# EAGLE design VCLFO_th_2 (EAGLE 7.7.0)
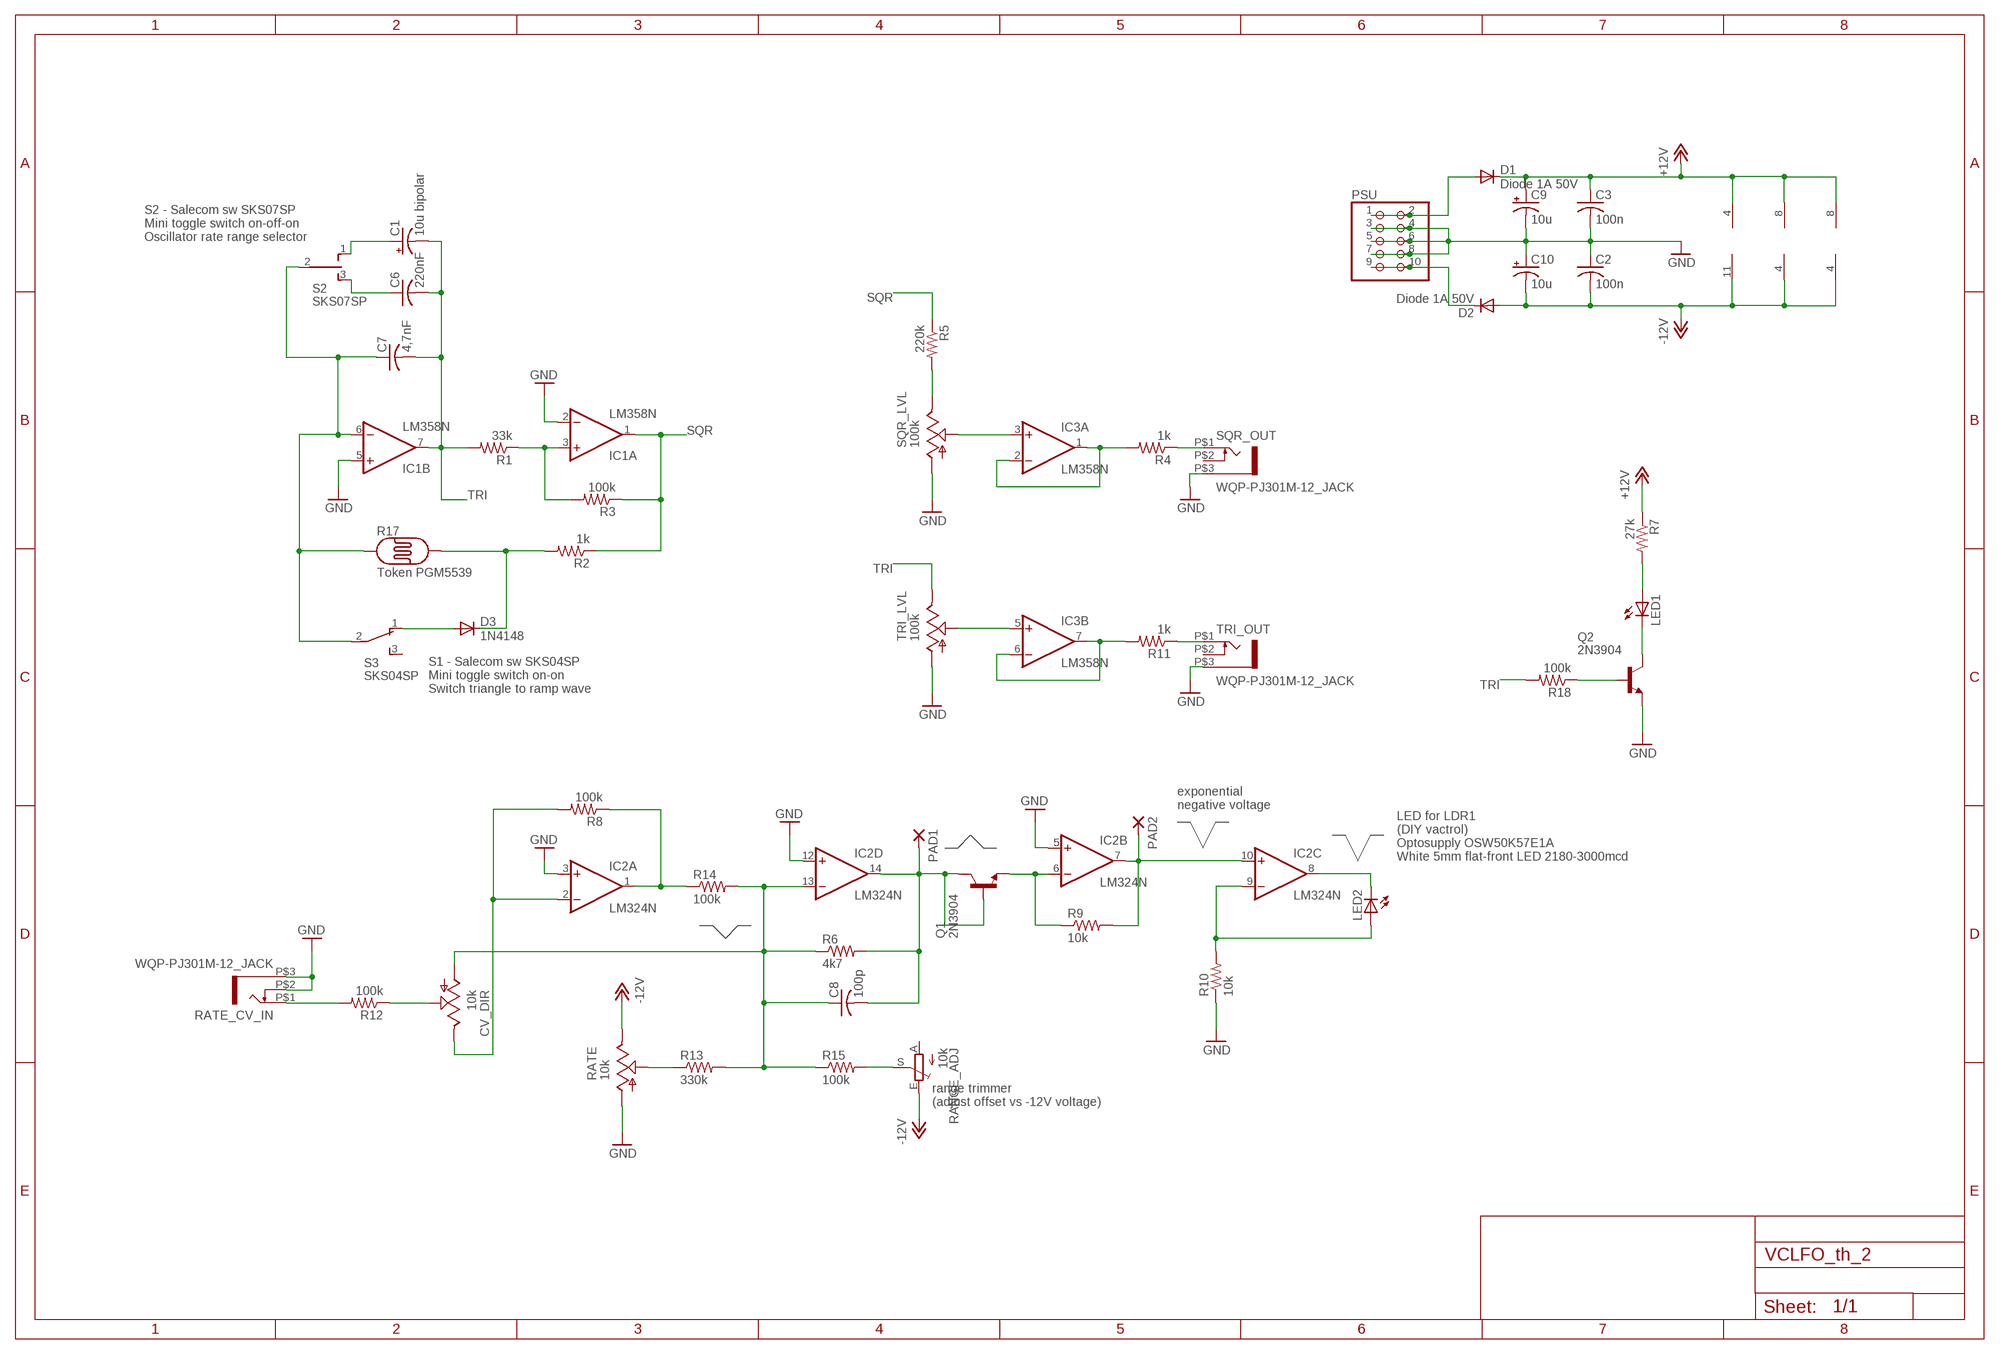
[diagram p0: schematic, sheet 1]

## Parts
C1  10u bipolar  CPOL-USE2.5-5  [E2,5-5]
C2  100n  C-US025-025X050  [C025-025X050]
C3  100n  C-US025-025X050  [C025-025X050]
C6  220nF  C-US050-025X075  [C050-025X075]
C7  4,7nF  C-US025-025X050  [C025-025X050]
C8  100p  C-US025-025X050  [C025-025X050]
C9  10u  CPOL-USE2.5-5  [E2,5-5]
C10  10u  CPOL-USE2.5-5  [E2,5-5]
CV_DIR  10k  POT_USVERTICAL  [ALPS_POT_VERTICAL]
D1  Diode 1A 50V  DIODE-D-2.5  [D-2.5]
D2  Diode 1A 50V  DIODE-D-2.5  [D-2.5]
D3  1N4148  DIODE-D-5  [D-5]
IC1  LM358N  [DIL08]
IC2  LM324N  [DIL14]
IC3  LM358N  [DIL08]
LED1  LED5MM  [LED5MM]
LED2  LED5MM  [LED5MM]
PAD1  1,6/0,8  [1,6/0,8]
PAD2  1,6/0,8  [1,6/0,8]
PSU  PINHD-2X5  [2X05]
Q1  2N3904  [TO92]
Q2  2N3904  [TO92]
R1  33k  R-US_0204/2V  [0204V]
R2  1k  R-US_0204/2V  [0204V]
R3  100k  R-US_0204/2V  [0204V]
R4  1k  R-US_0204/2V  [0204V]
R5  220k  R-US_0204/2V  [0204V]
R6  4k7  R-US_0204/2V  [0204V]
R7  27k  R-US_0204/2V  [0204V]
R8  100k  R-US_0204/2V  [0204V]
R9  10k  R-US_0204/2V  [0204V]
R10  10k  R-US_0204/2V  [0204V]
R11  1k  R-US_0204/2V  [0204V]
R12  100k  R-US_0204/2V  [0204V]
R13  330k  R-US_0204/2V  [0204V]
R14  100k  R-US_0204/2V  [0204V]
R15  100k  R-US_0204/2V  [0204V]
R17  Token PGM5539  PHOTOCELLPTH  [PHOTOCELL]
R18  100k  R-US_0204/2V  [0204V]
RANGE_ADJ  10k  TRIM_EU-B25P  [B25P]
RATE  10k  POT_USVERTICAL  [ALPS_POT_VERTICAL]
RATE_CV_IN  WQP-PJ301M-12_JACK  [WQP-PJ301M-12_JACK]
S2  SKS07SP  TL39PO  [TL3XPO]
S3  SKS04SP  TL36PO  [TL3XPO]
SQR_LVL  100k  POT_USVERTICAL  [ALPS_POT_VERTICAL]
SQR_OUT  WQP-PJ301M-12_JACK  [WQP-PJ301M-12_JACK]
TRI_LVL  100k  POT_USVERTICAL  [ALPS_POT_VERTICAL]
TRI_OUT  WQP-PJ301M-12_JACK  [WQP-PJ301M-12_JACK]

## Nets
+12V: C3.1 C9.+ D1.C IC1.8(P:V+) IC2.4(P:V+) IC3.8(P:V+) R7.1
-12V: C2.2 C10.- D2.A IC1.4(P:V-) IC2.11(P:V-) IC3.4(P:V-) RANGE_ADJ.E RATE.P$1(E)
GND: C2.1 C3.2 C9.- C10.+ IC1.2(A:-IN) IC1.5(B:+IN) IC2.3(A:+IN) IC2.5(B:+IN) IC2.12(D:+IN) PSU.3 PSU.4 PSU.5 PSU.6 PSU.7 PSU.8 Q2.3(E) R10.1 RATE.P$3(A) RATE_CV_IN.P$2 RATE_CV_IN.P$3 SQR_LVL.P$3(A) SQR_OUT.P$3 TRI_LVL.P$3(A) TRI_OUT.P$3
N$1: C7.1 IC1.6(B:-IN) R17.1 S2.2(P) S3.2(P)
N$2: D3.C R2.2 R17.2
N$3: IC3.1(A:OUT) IC3.2(A:-IN) R4.2
N$4: R5.2 SQR_LVL.P$1(E)
N$5: IC1.3(A:+IN) R1.1 R3.2
N$6: R4.1 SQR_OUT.P$1
N$7: CV_DIR.P$1(E) IC2.2(A:-IN) R8.2
N$8: IC3.6(B:-IN) IC3.7(B:OUT) R11.2
N$9: IC3.3(A:+IN) SQR_LVL.P$2(S)
N$10: D1.A PSU.1 PSU.2
N$11: D2.C PSU.9 PSU.10
N$12: R12.2 RATE_CV_IN.P$1
N$13: C8.2 IC2.14(D:OUT) PAD1.1(P) Q1.1(C) Q1.2(B) R6.2
N$14: C1.+ S2.1(O)
N$15: CV_DIR.P$2(S) R12.1
N$16: D3.A S3.1(O)
N$17: R11.1 TRI_OUT.P$1
N$18: R13.1 RATE.P$2(S)
N$19: C6.1 S2.3(S)
N$20: Q2.2(B) R18.1
N$21: IC2.6(B:-IN) Q1.3(E) R9.1
N$22: IC2.1(A:OUT) R8.1 R14.1
N$23: C8.1 CV_DIR.P$3(A) IC2.13(D:-IN) R6.1 R13.2 R14.2 R15.1
N$24: IC2.7(B:OUT) IC2.10(C:+IN) PAD2.1(P) R9.2
N$25: R15.2 RANGE_ADJ.S
N$26: IC2.8(C:OUT) LED2.K(C)
N$27: IC2.9(C:-IN) LED2.A R10.2
N$28: IC3.5(B:+IN) TRI_LVL.P$2(S)
N$30: LED1.K(C) Q2.1(C)
N$31: LED1.A R7.2
SQR: IC1.1(A:OUT) R2.1 R3.1 R5.1
TRI: C1.- C6.2 C7.2 IC1.7(B:OUT) R1.2 R18.2 TRI_LVL.P$1(E)
Unconnected: RANGE_ADJ.A S3.3(S) SQR_OUT.P$2 TRI_OUT.P$2

## Notes on the sheet
- S2 - Salecom sw SKS07SP
  Mini toggle switch on-off-on
  Oscillator rate range selector
- S1 - Salecom sw SKS04SP
  Mini toggle switch on-on
  Switch triangle to ramp wave
- exponential
  negative voltage
- LED for LDR1
  (DIY vactrol)
  Optosupply OSW50K57E1A
  White 5mm flat-front LED 2180-3000mcd
- range trimmer
  (adjust offset vs -12V voltage)

## Library data of the parts
C1 C9 C10 = rcl:CPOL-US: POLARIZED CAPACITOR, American symbol
C2 C3 C6-C8 = rcl:C-US: CAPACITOR, American symbol
CV_DIR RATE SQR_LVL TRI_LVL = pot-alps:POT_US
D1-D3 = diode:DIODE-: DIODE
IC1 IC3 = linear:LM358: OP AMP also LM158; LM258; LM2904 Source: http://cache.national.com/ds/LM/LM158.pdf
IC2 = linear:LM324: OP AMP
LED1 LED2 = led:LED: LED OSRAM: - CHIPLED LG R971, LG N971, LY N971, LG Q971, LY Q971, LO R971, LY R971 LH N974, LH R974 LS Q976, LO Q976, LY Q976 LO Q996 - Hyper CHIPLED LW Q18S LB Q993, LB Q99A, LB R99A - SideLED LS A670, LO A670, LY A670, LG A670, LP A670 LB A673, LV A673, LT A673, LW A673 LH A674 LY A675 LS A676, LA A676, LO A676, LY A676, LW A676 LS A679, LY A679, LG A679 - Hyper Micro SIDELED® LS Y876, LA Y876, LO Y876, LY Y876 LT Y87S - SmartLED LW L88C, LW L88S LB L89C, LB L89S, LG L890 LS L89K, LO L89K, LY L89K LS L896, LA L896, LO L896, LY L896 - TOPLED LS T670, LO T670, LY T670, LG T670, LP T670 LSG T670, LSP T670, LSY T670, LOP T670, LYG T670 LG T671, LOG T671, LSG T671 LB T673, LV T673, LT T673, LW T673 LH T674 LS T676, LA T676, LO T676, LY T676, LB T676, LH T676, LSB T676, LW T676 LB T67C, LV T67C, LT T67C, LS T67K, LO T67K, LY T67K, LW E67C LS E67B, LA E67B, LO E67B, LY E67B, LB E67C, LV E67C, LT E67C LW T67C LS T679, LY T679, LG T679 LS T770, LO T770, LY T770, LG T770, LP T770 LB T773, LV T773, LT T773, LW T773 LH T774 LS E675, LA E675, LY E675, LS T675 LS T776, LA T776, LO T776, LY T776, LB T776 LHGB T686 LT T68C, LB T68C - Hyper Mini TOPLED® LB M676 - Mini TOPLED Santana® LG M470 LS M47K, LO M47K, LY M47K Source: http://www.osram.convergy.de LUXEON: - LUMILED® LXK2-PW12-R00, LXK2-PW12-S00, LXK2-PW14-U00, LXK2-PW14-V00 LXK2-PM12-R00, LXK2-PM12-S00, LXK2-PM14-U00 LXK2-PE12-Q00, LXK2-PE12-R00, LXK2-PE12-S00, LXK2-PE14-T00, LXK2-PE14-U00 LXK2-PB12-K00, LXK2-PB12-L00, LXK2-PB12-M00, LXK2-PB14-N00, LXK2-PB14-P00, LXK2-PB14-Q00 LXK2-PR12-L00, LXK2-PR12-M00, LXK2-PR14-Q00, LXK2-PR14-R00 LXK2-PD12-Q00, LXK2-PD12-R00, LXK2-PD12-S00 LXK2-PH12-R00, LXK2-PH12-S00 LXK2-PL12-P00, LXK2-PL12-Q00, LXK2-PL12-R00 Source: www.luxeon.com KINGBRIGHT: KA-3528ASYC Source: www.kingbright.com
PAD1 PAD2 = wirepad:1,6/0,8: THROUGH-HOLE PAD
PSU = pinhead:PINHD-2X5: PIN HEADER
Q1 Q2 = transistor-npn:2N3904: NPN Transistor
R1-R15 R18 = rcl:R-US_: RESISTOR, American symbol
R17 = SparkFun-Sensors:PHOTOCELL: CdS photoresistor. This is a low cost way to detect light levels. Resistance decreases with more incoming light. SparkFun SKU: SEN-09088
RANGE_ADJ = pot:TRIM_EU-: POTENTIOMETER
RATE_CV_IN SQR_OUT TRI_OUT = thonkiconn:WQP-PJ301M-12_JACK
S2 = switch:TL39PO: TINY SWITCH ON OFF ON Source: http://www2.produktinfo.conrad.com/datenblaetter/700000-724999/705152-da-01-de-Subminiaturschalter_TL_36YO.pdf
S3 = switch:TL36PO: TINY SWITCH ON - ON Source: http://www2.produktinfo.conrad.com/datenblaetter/700000-724999/705152-da-01-de-Subminiaturschalter_TL_36YO.pdf

## Board
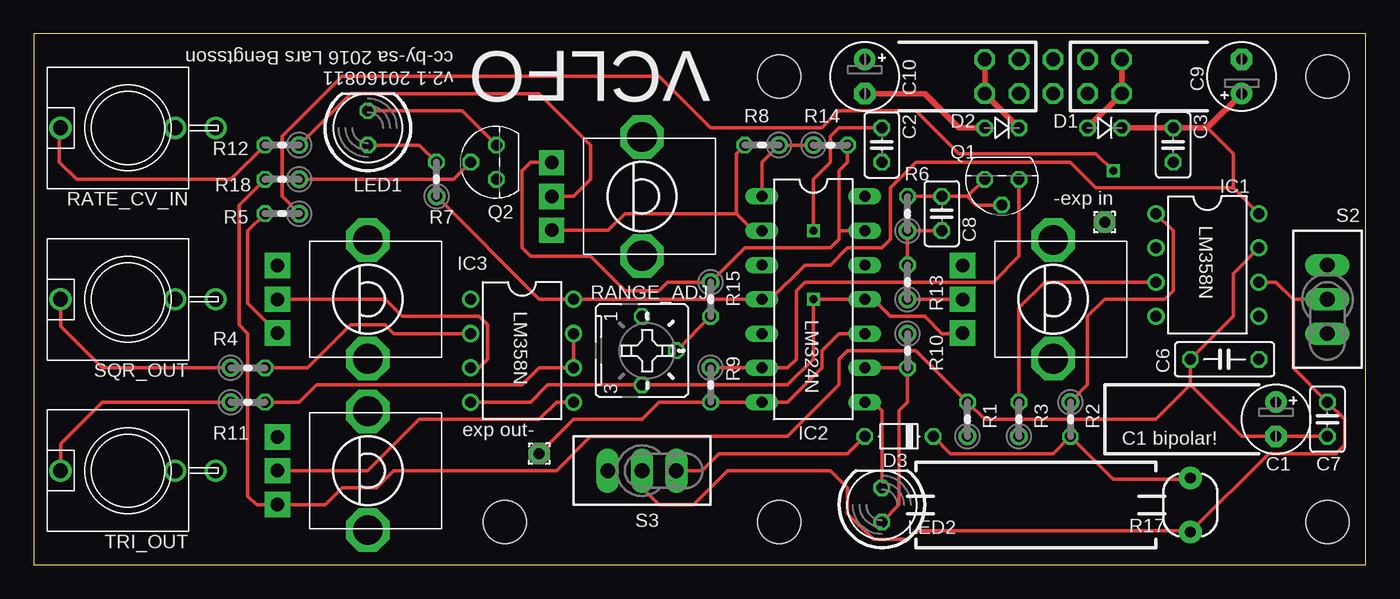
[diagram p1: board, top side]
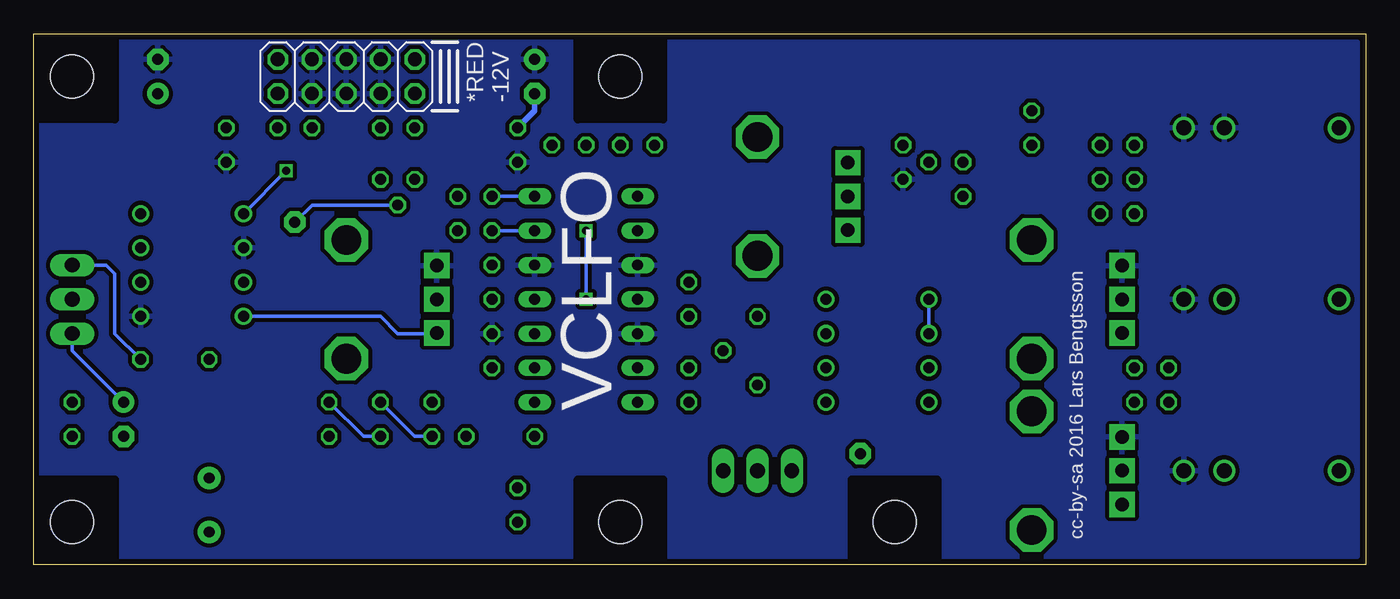
[diagram p2: board, bottom side, seen from below]

Size 98.73 x 39.36 mm. Coordinates in mm from the lower left corner, seen from the top.
Outline: 0,0 98.73,0 98.73,39.36 0,39.36 0,0
Copper layers (1*16): Top 0.0356mm / dielectric 1.5011mm / Bottom 0.0356mm
Design rules "LaenPCBOrder": minimum track width 6mil, minimum drill 13mil, track to track 6mil, track to pad 6mil, pad to pad 6mil, via to via 6mil, smd to smd 6mil, copper to edge 15mil, drill to drill 6mil, minimum pad ring 7mil, minimum via ring 7mil, stop-mask expansion 3mil, vias tented up to drill 0mil, thermal gap 10mil
Holes 3.2 mm at 95.88,36.2 95.88,3.18 55.25,3.18 34.93,3.18 55.25,36.2
bRestrict: area 52.1,33 to 58.4,39.4; area 31.8,0 to 38.1,6.4; area 52.1,0 to 58.4,6.4; area 92.7,0 to 99.1,6.4; area 92.7,33 to 99.1,39.4

### Footprints (pad centres in the part's own frame; a part is rotated, then mirrored left to right if it is on the bottom)
E2,5-5 = drill 0.813 pad 1.6: + -1.27,0 | drill 0.813 pad 1.6 octagon: - 1.27,0
C025-025X050 = drill 0.813 octagon: 1 -1.27,0; 2 1.27,0
C050-025X075 = drill 0.813 octagon: 1 -2.54,0; 2 2.54,0
ALPS_POT_VERTICAL = drill 1 pad 1.88 square: P$1 -2.5,6.7; P$2 0,6.7; P$3 2.5,6.7 | drill 2.2 pad 3.175 octagon: P$4 -4.4,0; P$5 4.4,0
D-2.5 = drill 0.813 octagon: A 1.27,0; C -1.27,0
D-5 = drill 0.813 octagon: A 2.54,0; C -2.54,0
DIL08 = drill 0.813 pad 1.27: 1 -3.81,-3.81; 2 -1.27,-3.81; 3 1.27,-3.81; 4 3.81,-3.81; 5 3.81,3.81; 6 1.27,3.81; 7 -1.27,3.81; 8 -3.81,3.81
DIL14 = drill 0.813 long: 1 -7.62,-3.81; 2 -5.08,-3.81; 3 -2.54,-3.81; 4 0,-3.81; 5 2.54,-3.81; 6 5.08,-3.81; 7 7.62,-3.81; 8 7.62,3.81; 9 5.08,3.81; 10 2.54,3.81; 11 0,3.81; 12 -2.54,3.81; 13 -5.08,3.81; 14 -7.62,3.81
LED5MM = drill 0.813 octagon: A -1.27,0; K 1.27,0
1,6/0,8 = drill 0.813 pad 1.6 octagon: 1 0,0
2X05 = drill 1.016 octagon: 1 -5.08,-1.27; 2 -5.08,1.27; 3 -2.54,-1.27; 4 -2.54,1.27; 5 0,-1.27; 6 0,1.27; 7 2.54,-1.27; 8 2.54,1.27; 9 5.08,-1.27; 10 5.08,1.27
TO92 = drill 0.813 octagon: 1 1.27,0; 2 0,1.905; 3 -1.27,0
0204V = drill 0.813 octagon: 1 -1.27,0; 2 1.27,0
PHOTOCELL = drill 0.8 pad 1.676: 1 -2,0; 2 2,0
B25P = drill 0.813 octagon: A -2.54,0; E 2.54,0; S 0,2.54
WQP-PJ301M-12_JACK = drill 1.1: P$1 0,5; P$2 0,-3.5; P$3 0,-6.5
TL3XPO = drill 1.1 pad 1.422 long: 1 -2.54,0; 2 0,0; 3 2.54,0

### Placement (x,y rotation side)
C1  92.07,10.8 270 top
C2  62.87,31.12 90 top
C3  84.45,31.12 270 top
C6  88.27,15.24 180 top
C7  95.88,10.8 270 top
C8  67.31,26.04 90 top
C9  89.53,36.2 90 top
C10  61.59,36.2 270 top
CV_DIR  45.09,27.3 90 top
D1  79.38,32.39 180 top
D2  71.75,32.39 180 top
D3  64.13,9.53 180 top
IC1  86.99,22.23 270 top
IC2  57.79,19.69 270 top
IC3  36.2,15.88 270 top
LED1  24.76,32.39 90 top
LED2  62.87,4.45 90 top
PAD1  79.38,25.4 0 top
PAD2  37.47,8.26 0 top
PSU  75.56,36.2 0 bottom
Q1  71.75,28.58 180 top
Q2  34.29,29.84 90 top
R1  69.21,10.8 90 top
R2  76.83,10.8 270 top
R3  73.02,10.8 90 top
R4  15.88,14.61 0 top
R5  18.41,26.04 180 top
R6  64.77,26.04 90 top
R7  29.84,28.58 90 top
R8  53.98,31.12 180 top
R9  50.16,13.34 270 top
R10  64.77,15.88 270 top
R11  15.88,12.07 0 top
R12  18.41,31.12 180 top
R13  64.77,20.95 90 top
R14  59.05,31.12 0 top
R15  50.16,19.69 270 top
R17  85.72,4.45 90 top
R18  18.41,28.58 180 top
RANGE_ADJ  45.09,15.88 270 top
RATE  75.56,19.69 90 top
RATE_CV_IN  6.99,32.39 90 top
S2  95.88,19.69 90 top
S3  45.09,6.99 180 top
SQR_LVL  24.76,19.69 90 top
SQR_OUT  6.99,19.69 90 top
TRI_LVL  24.76,6.99 90 top
TRI_OUT  6.99,6.99 90 top

### Tracks (layer width: path | path; a pad name or v marks a point on that pad's centre or on a via)
+12V
  Top 0.254: R7.1 37.47,19.69 IC3.8 IC2.4 54.61,19.69 57.15,22.23 59.05,22.23 60.33,23.5 62.87,23.5 63.5,24.13 63.5,27.94 65.41,29.84 76.83,29.84 78.74,27.94 88.9,27.94 | 88.9,27.94 IC1.8 | 88.9,27.94 88.9,30.48 86.99,32.39
  Top 0.406: D1.C C3.1 86.99,32.39 C9.+
-12V  (via drill 0.6)
  Top 0.254: RATE.P$1 68.82,17.15 67.31,17.15 66.04,18.41 63.5,18.41 62.23,19.69 IC2.11 v57.79,19.69 57.79,15.24 55.88,13.34 RANGE_ADJ.E 38.1,13.34 36.83,12.07 IC3.4 | v57.79,24.77 57.79,28.58 59.05,29.84 59.05,31.75 59.69,32.39 C2.2
  Top 0.406: C10.- 66.04,34.93 68.58,32.39 D2.A
  Bottom 0.254: v57.79,24.77 v57.79,19.69 | IC1.4 73.02,18.41 71.75,17.15 68.91,17.15 RATE.P$1
  Bottom 0.406: C2.2 61.59,33.66 C10.-
GND
  pour Bottom (isolate 0.305): 0.64,38.73 98.42,38.73 98.42,0.64 0.64,0.64
N$1
  Top 0.254: S3.2 45.09,5.72 46.36,4.45 48.9,4.45 51.44,6.99 59.05,6.99 60.33,5.72 60.33,3.81 62.23,1.91 64.77,1.91 65.41,2.54 85.63,2.54 R17.1 91.53,8.26 96.52,8.26 97.16,8.89 97.16,10.8 C7.1 93.34,14.61 93.34,19.69 | IC1.6 92.07,20.95 93.34,19.69 | 93.34,19.69 S2.2
N$2
  Top 0.254: D3.C 67.94,8.26 75.56,8.26 R2.2 80.01,6.35 85.63,6.35 R17.2
N$3
  Top 0.254: IC3.2 26.67,17.15 26.04,17.78 23.49,17.78 20.32,14.61 R4.2
  Bottom 0.254: IC3.1 IC3.2
N$4
  Top 0.254: R5.2 15.88,24.77 15.88,19.38 SQR_LVL.P$1
N$5
  Top 0.254: IC1.3 74.93,20.95 73.02,19.05 R3.2
  Bottom 0.254: R1.1 70.48,9.53 R3.2
N$6
  Top 0.254: SQR_OUT.P$1 1.99,17.7 5.08,14.61 R4.1
N$7
  Top 0.254: IC2.2 53.34,24.77 52.07,26.04 | 52.07,26.04 52.07,30.48 R8.2 | CV_DIR.P$1 42.59,24.8 43.82,26.04 52.07,26.04
N$8
  Top 0.254: R11.2 19.68,12.07 20.95,13.34 36.2,13.34 37.47,14.61 IC3.6 IC3.7
N$9
  Top 0.254: IC3.3 33.02,14.61 33.66,15.24 33.66,17.78 33.02,18.41 27.3,18.41 26.04,19.69 SQR_LVL.P$2
N$10
  Top 0.406: PSU.2 PSU.1 D1.A
N$11
  Top 0.406: PSU.10 PSU.9 D2.C
N$12
  Top 0.254: R12.2 14.61,28.58 3.17,28.58 1.91,29.84 1.91,32.3 RATE_CV_IN.P$1
N$13
  Top 0.254: R6.2 C8.2 69.21,27.3 | 69.21,27.3 Q1.1 | Q1.2 69.85,26.67 69.21,27.3
  Bottom 0.254: IC2.14 R6.2 | Q1.2 78.1,26.67 PAD1.1
N$14
  Bottom 0.254: S2.1 95.88,15.88 C1.+
N$15
  Top 0.254: R12.1 23.49,34.93 37.47,34.93 41.27,31.12 41.27,28.58 40.01,27.3 CV_DIR.P$2
N$16
  Top 0.254: S3.1 49.53,6.99 50.8,8.26 60.33,8.26 D3.A
N$17
  Top 0.254: TRI_OUT.P$1 1.99,8.97 5.08,12.07 R11.1
N$18
  Top 0.254: RATE.P$2 R13.1
N$19
  Bottom 0.254: S2.3 93.34,22.23 92.71,21.59 92.71,17.15 C6.1
N$20
  Top 0.254: Q2.2 31.11,28.58 R18.1
N$21
  Top 0.254: R9.1 IC2.6 55.88,14.61 56.52,15.24 56.52,20.32 57.15,20.95 71.12,20.95 73.02,22.86 Q1.3
N$22
  Top 0.254: R14.1 R8.1 53.98,29.84 IC2.1
N$23
  Top 0.254: R14.2 60.33,29.84 59.69,29.21 59.69,24.77 | 60.96,24.77 IC2.13 59.69,24.77 | 59.69,24.77 59.69,24.13 59.05,23.5 52.71,23.5 R15.1 46.99,20.95 46.36,20.32 43.82,20.32 41.27,22.86 36.83,22.86 36.2,23.5 36.2,29.21 36.83,29.84 38.34,29.84 CV_DIR.P$3 | R13.2 R6.1 C8.1
  Bottom 0.254: IC2.13 R6.1
N$24
  Top 0.254: IC2.10 59.69,17.15 58.42,15.88 58.42,14.61 55.88,12.07 IC2.7 R9.2 46.36,12.07 45.09,10.8 40.01,10.8 PAD2.1
N$25
  Top 0.254: R15.2 RANGE_ADJ.S
N$26
  Top 0.254: LED2.K 62.87,11.43 62.23,12.07 IC2.8
N$27
  Top 0.254: IC2.9 R10.2 64.77,12.07 64.13,11.43 64.13,4.45 LED2.A
N$28
  Top 0.254: IC3.5 38.73,12.07 37.47,10.8 28.57,10.8 24.76,6.99 TRI_LVL.P$2
N$30
  Top 0.254: LED1.K 31.75,33.66 Q2.1
N$31
  Top 0.254: LED1.A 28.57,31.12 R7.2
SQR  (via drill 0.6)
  Top 0.254: R5.1 18.41,27.3 18.41,31.75 22.86,36.2 46.36,36.2 50.16,32.39 58.42,32.39 59.69,33.66 65.41,33.66 68.58,30.48 78.74,30.48 v80.01,29.21 | IC1.1 84.45,24.77 84.45,20.32 83.82,19.69 79.38,19.69 78.1,18.41 78.1,13.34 R2.1
  Bottom 0.254: R3.1 74.3,9.53 R2.1 | v80.01,29.21 IC1.1
TRI
  Top 0.254: R18.2 15.24,26.67 15.24,17.78 15.88,17.15 15.88,5.08 16.51,4.45 18.02,4.45 TRI_LVL.P$1 18.1,4.45 21.59,4.45 22.86,5.72 25.4,5.72 26.67,6.99 38.73,6.99 41.27,9.53 55.88,9.53 59.69,13.34 59.69,15.24 60.33,15.88 65.41,15.88 R1.2 70.48,10.8 83.18,10.8 85.72,13.34 | C7.2 C1.- 89.53,9.53 85.72,13.34 | 85.72,13.34 C6.2 88.9,18.41 88.9,21.59 IC1.7

### Text on the board
tPlace: v2.1 20160811 / cc-by-sa 2016 Lars Bengtsson | VCLFO | -exp in | exp out- | C1 bipolar!
bPlace: *RED / -12V | VCLFO | cc-by-sa 2016 Lars Bengtsson